# EAGLE schematic power_3.4v (EAGLE 9.6.2)
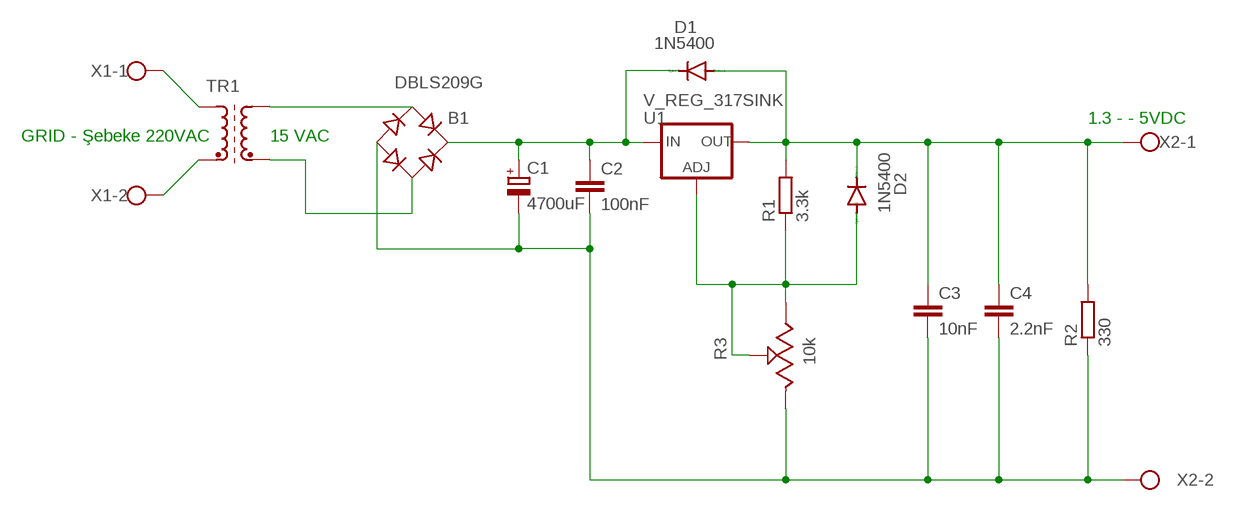
[diagram p0: schematic, sheet 1]

## Parts
B1  DBLS209G  [DBS]
C1  4700uF  CPOL-EU140CLH-1010  [140CLH-1010]
C2  100nF  C-EU025-025X050  [C025-025X050]
C3  10nF  C-EU025-025X050  [C025-025X050]
C4  2.2nF  C-EU025-025X050  [C025-025X050]
D1  1N5400  [DO201-15]
D2  1N5400  [DO201-15]
R1  3.3k  R-EU_0204/7  [0204/7]
R2  330  R-EU_0204/7  [0204/7]
R3  10k  3310C-001-503L  [3310C-001-503L]
TR1  SM-T4  [SM-T4]
U1  V_REG_317SINK  [TO220-ADJ]
X1  W237-102  [W237-102]
X2  W237-102  [W237-102]

## Nets
N$1: B1.AC1 TR1.5(A2)
N$2: B1.AC2 TR1.4(E2)
N$3: B1.- C1.- C2.2 C3.2 C4.2 R2.1 R3.1 X2.2
N$4: B1.+ C1.+ C2.1 D1.C U1.IN
N$5: C3.1 C4.1 D1.A D2.C R1.2 R2.2 U1.OUT X2.1
N$6: D2.A R1.1 R3.2 R3.3 U1.ADJ
N$7: TR1.1(A1) X1.1
N$8: TR1.2(E1) X1.2

## Notes on the sheet
- 1.3 - - 5VDC
- GRID - Şebeke 220VAC | 15 VAC

## Library data of the parts
B1 = rectifier:DB?*G: Single Phase 1.0 AMP Glass Passivated Bridge Rectifier Taiwan Semiconductor Co.,Ltd. - TSC Source: http://www.taiwansemi.com/TSCbig5/ezcatfiles/cust/img/img/db101g.pdf http://www.ts.com.tw/db/pictures/modules/PDT/PDT060207001/DBLS201G.pdf
C1 = rcl:CPOL-EU: POLARIZED CAPACITOR, European symbol; SPICEPREFIX: C
C2-C4 = rcl:C-EU: CAPACITOR, European symbol; SPICEPREFIX: C
D1 D2 = diode:1N5400: DIODE standard rectifier, 3 A, 50 V (Motorola)
R1 R2 = rcl:R-EU_: RESISTOR, European symbol; SPICEPREFIX: R
R3 = Potentiometer_Trimmers:3310C-001-503L: POT 50K OHM 1/4W PLASTIC LINEAR Manufacturer's datasheet <https://www.bourns.com/docs/Product-Datasheets/3310.pdf>; CREATED_BY: PCBLayout.com; DIGIKEY_PARTNO: 3310C-001-503L-ND; MANUFACTURER: Bourns Inc.; MPN: 3310C-001-503L
TR1 = inductor-neosid:SM-T4: TRANSFORMER SMD wideband transformer; OC_FARNELL: unknown; OC_NEWARK: unknown
U1 = SparkFun-IC-Power:V_REG_317: Voltage Regulator Standard LM317 adjustable voltage regulator. AOI (Adjust Output Input). Google 'LM317 Calculator' for easy to use app to get the two resistor values needed. 240/720 for 5V output. 240/390 for 3.3V output. Spark Fun Electronics SKU : COM-00527
X1 X2 = con-wago-500:W237-102: WAGO SCREW CLAMP; MPN: 237-102; OC_FARNELL: unknown; OC_NEWARK: 70K9898